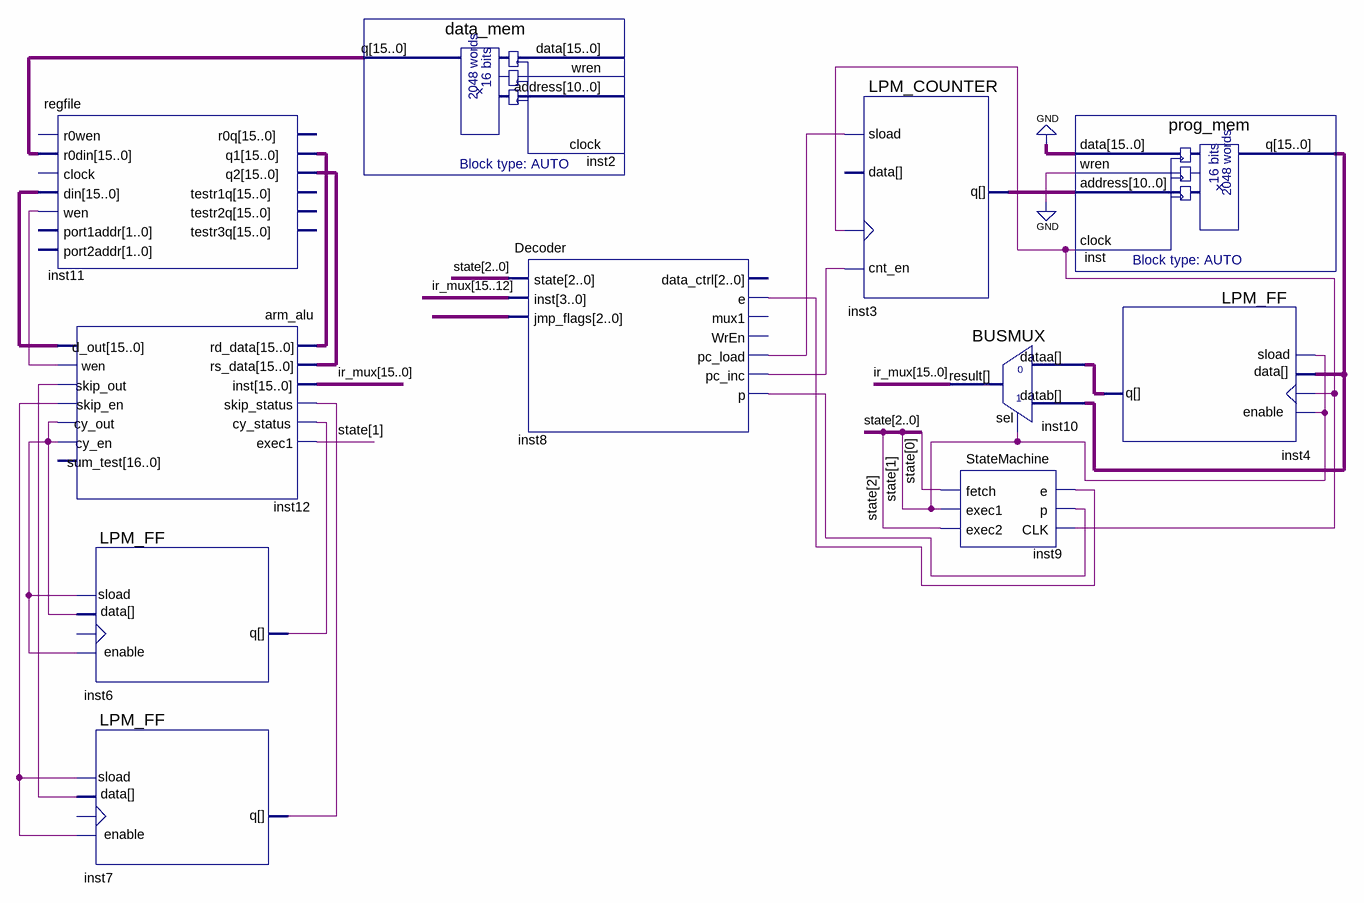
[diagram p0: schematic sheet]
// Quartus schematic HarvardArch.bdf as structural Verilog: 11 symbols, 0 pins
module HarvardArch (
);

  wire inst4_q, inst6_q, inst7_q, inst8_e, inst8_p, inst8_pc_inc, inst8_pc_load, inst12_cy_out,
       inst12_skip_en, inst12_skip_out, inst12_wen, undriven;
  wire [2:0] state, undriven_2;
  wire [10:0] inst3_q;
  wire [15:0] inst2_q, inst11_q1, inst11_q2, inst12_d_out, inst_q, ir_mux;

  regfile inst11 (
    .r0din(inst2_q), .din(inst12_d_out), .wen(inst12_wen), .q1(inst11_q1), .q2(inst11_q2));  // open: r0wen, clock, port1addr, port2addr, r0q, testr1q, testr2q, testr3q
  arm_alu inst12 (
    .rd_data(inst11_q1), .rs_data(inst11_q2), .inst(ir_mux), .skip_status(inst7_q), .cy_status(inst6_q),
    .exec1(state[1]), .d_out(inst12_d_out), .wen(inst12_wen), .skip_out(inst12_skip_out),
    .skip_en(inst12_skip_en), .cy_out(inst12_cy_out), .cy_en(inst12_cy_out));  // open: sum_test
  LPM_FF inst6 (.data(inst12_cy_out), .enable(inst12_cy_out), .sload(inst12_cy_out), .q(inst6_q));  // open: clock
  LPM_FF inst7 (.data(inst12_skip_out), .enable(inst12_skip_en), .sload(inst12_skip_en), .q(inst7_q));  // open: clock
  data_mem inst2 (.q(inst2_q));  // open: data, wren, address, clock
  Decoder inst8 (
    .state(state), .inst(ir_mux[15:12]), .jmp_flags(undriven_2), .e(inst8_e), .pc_load(inst8_pc_load),
    .pc_inc(inst8_pc_inc), .p(inst8_p));  // open: data_ctrl, mux1, WrEn
  LPM_COUNTER inst3 (.clock(undriven), .cnt_en(inst8_pc_inc), .sload(inst8_pc_load), .q(inst3_q));  // open: data
  BUSMUX inst10 (.datab(inst_q), .sel(state[1]), .dataa(inst4_q), .result(ir_mux));
  StateMachine inst9 (.e(inst8_e), .p(inst8_p), .CLK(undriven), .fetch(state[0]), .exec1(state[1]), .exec2(state[2]));
  prog_mem inst (.data({16{1'b0}}), .wren(1'b0), .address(inst3_q), .clock(undriven), .q(inst_q));
  LPM_FF inst4 (.clock(undriven), .data(inst_q), .enable(state[1]), .sload(state[1]), .q(inst4_q));
endmodule
